# EAGLE design gm-board (EAGLE 6.6.0)
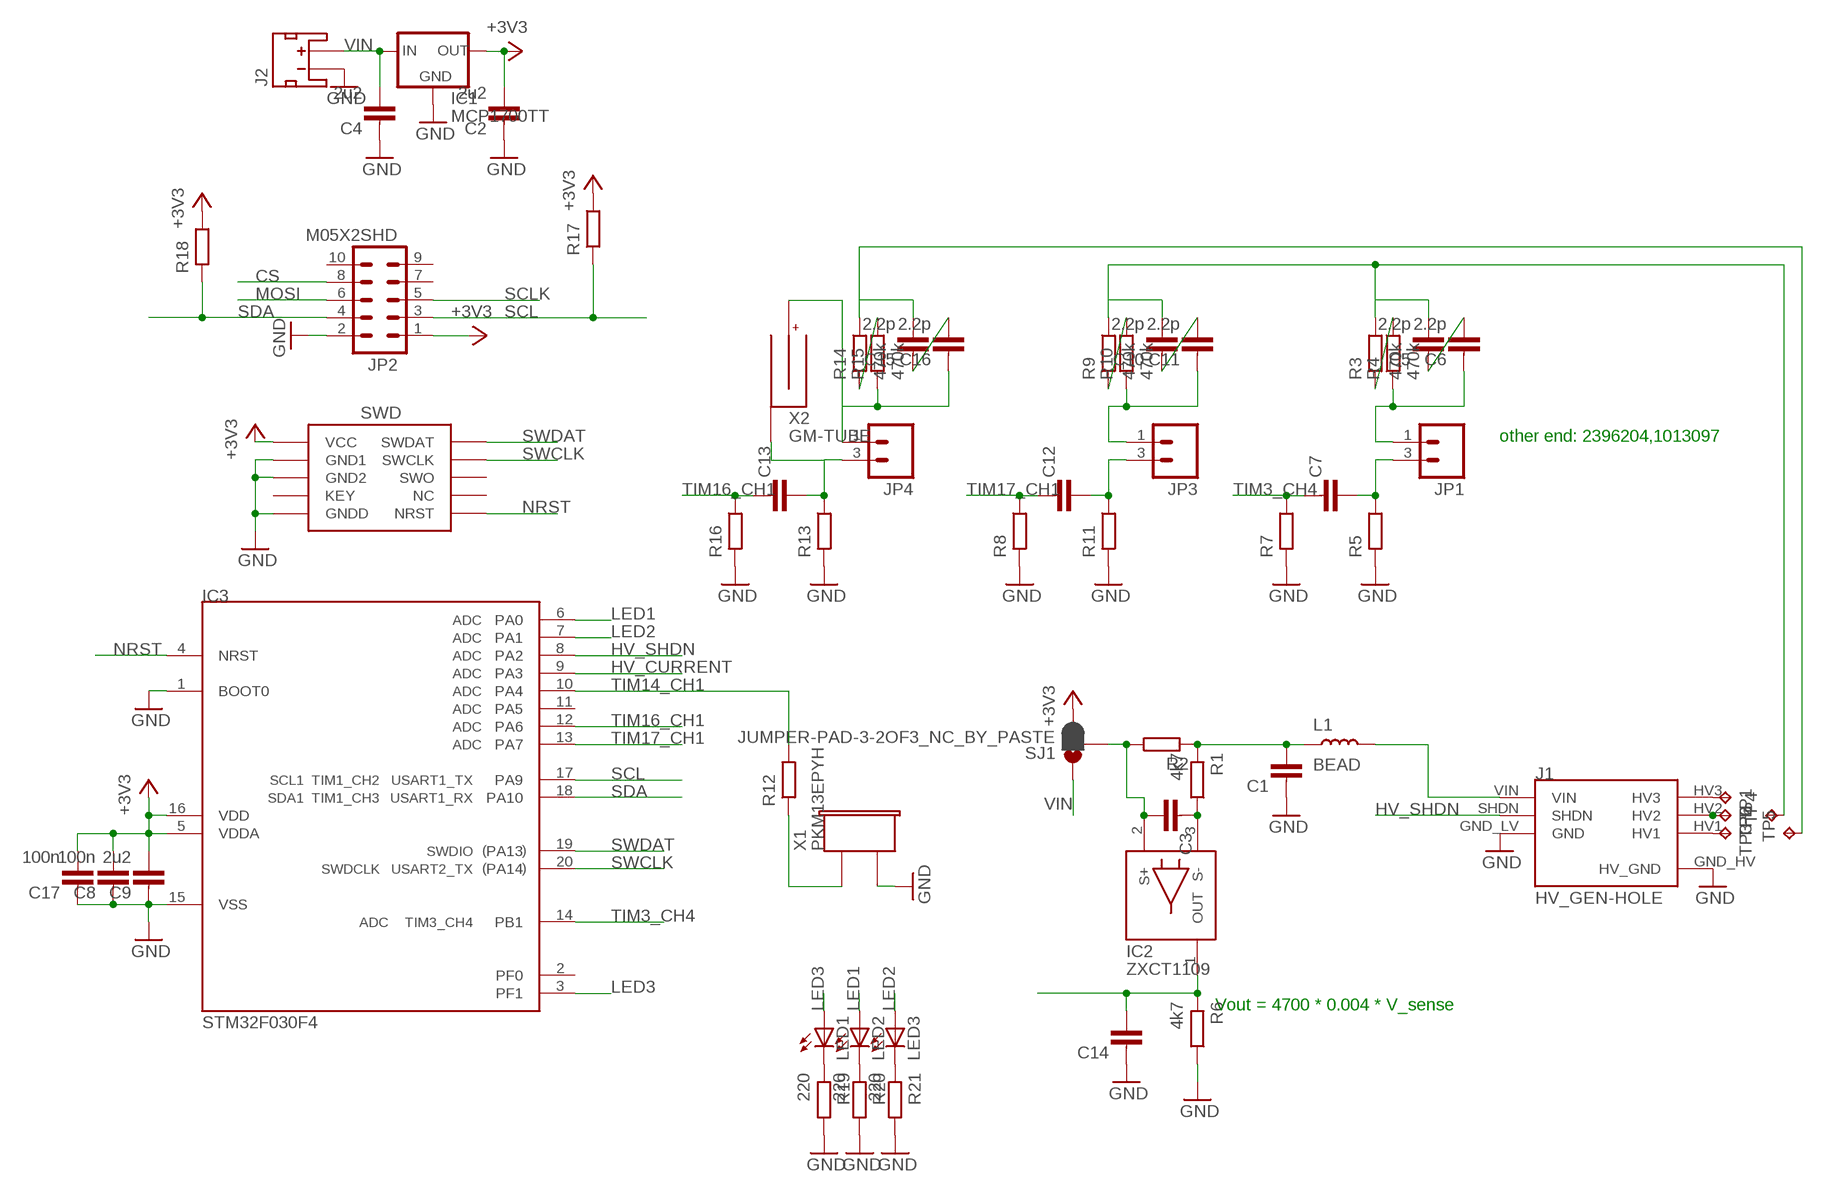
[diagram p0: schematic, sheet 1]

## Parts
C1  CAPACITOR0603-N  [C0603-N]
C2  2u2  CAPACITOR0603-N  [C0603-N]
C3  CAPACITOR0603-N  [C0603-N]
C4  2u2  CAPACITOR0603-N  [C0603-N]
C5  2.2p  CAPACITOR0805-N  [C0805-N]
C6  2.2p  CAPACITOR0805-N  [C0805-N]
C7  CAPACITOR0603-N  [C0603-N]
C8  100n  CAPACITOR0603-N  [C0603-N]
C9  2u2  CAPACITOR0603-N  [C0603-N]
C10  2.2p  CAPACITOR0805-N  [C0805-N]
C11  2.2p  CAPACITOR0805-N  [C0805-N]
C12  CAPACITOR0603-N  [C0603-N]
C13  CAPACITOR0603-N  [C0603-N]
C14  CAPACITOR0603-N  [C0603-N]
C15  2.2p  CAPACITOR0805-N  [C0805-N]
C16  2.2p  CAPACITOR0805-N  [C0805-N]
C17  100n  CAPACITOR0603-N  [C0603-N]
IC1  MCP1700TT  [SOT23]
IC2  ZXCT1109  [SOT23]
IC3  STM32F030F4  [TSSOP20]
J1  HV_GEN-HOLE  [BRD-LAYOUT2]
J2  JST_2MM_MALE_TH-NT  [JST-2-TH-NOTEXT]
J3  SWD_SHROUD  [SWD_PTH_SHROUD]
JP1  M02-HV  [M03-HV]
JP2  M05X2SHD  [2X5-SHROUDED]
JP3  M02-HV  [M03-HV]
JP4  M02-HV  [M03-HV]
L1  BEAD  INDUCTOR0603-N  [L0603-N]
LED1  LEDCHIPLED_0603  [CHIPLED_0603]
LED2  LEDCHIPLED_0603  [CHIPLED_0603]
LED3  LEDCHIPLED_0603  [CHIPLED_0603]
R1  4k7  RESISTOR0603-N  [R0603-N]
R2  RESISTOR0603-N  [R0603-N]
R3  470k  RESISTOR1206-N  [R1206-N]
R4  470k  RESISTOR1206-N  [R1206-N]
R5  RESISTOR0603-N  [R0603-N]
R6  4k7  RESISTOR0603-N  [R0603-N]
R7  RESISTOR0603-N  [R0603-N]
R8  RESISTOR0603-N  [R0603-N]
R9  470k  RESISTOR1206-N  [R1206-N]
R10  470k  RESISTOR1206-N  [R1206-N]
R11  RESISTOR0603-N  [R0603-N]
R12  RESISTOR0603-N  [R0603-N]
R13  RESISTOR0603-N  [R0603-N]
R14  470k  RESISTOR1206-N  [R1206-N]
R15  470k  RESISTOR1206-N  [R1206-N]
R16  RESISTOR0603-N  [R0603-N]
R17  RESISTOR0603-N  [R0603-N]
R18  RESISTOR0603-N  [R0603-N]
R19  220  RESISTOR0603-N  [R0603-N]
R20  220  RESISTOR0603-N  [R0603-N]
R21  220  RESISTOR0603-N  [R0603-N]
SJ1  JUMPER-PAD-3-2OF3_NC_BY_PASTE  [PAD-JUMPER-3-2OF3_NC_BY_PASTE_YES_SILK_FULL_BOX]
TP1  TPTP09R  [TP09R]
TP2  TPTP09R  [TP09R]
TP3  TPTP09R  [TP09R]
TP4  TPTP09R  [TP09R]
TP5  TPTP09R  [TP09R]
TP6  TPTP09R  [TP09R]
X1  PKM13EPYH  [PKM13EPYH]
X2  GM-TUBE  [GM-TUBE]

## Nets
+3V3: C2.2 C8.2 C9.2 C17.2 IC1.2(OUT) IC3.5(VDDA) IC3.16(VDD) J3.1(VCC) JP2.1 R17.2 R18.2 SJ1.3
CS: JP2.8
GND: C1.1 C2.1 C4.1 C8.1 C9.1 C14.1 C17.1 IC1.1(GND) IC3.1(BOOT0) IC3.15(VSS) J1.GND_HV(HV_GND) J1.GND_LV(GND) J2.2(-) J3.3(GND1) J3.5(GND2) J3.9(GNDD) JP2.2 R5.1 R6.2 R7.1 R8.1 R11.1 R13.1 R16.1 R19.2 R20.2 R21.2 X1.2
HV_CURRENT: C14.2 IC2.1(OUT) IC3.9(PA3) R6.1
HV_SHDN: IC3.8(PA2) J1.SHDN
LED1: IC3.6(PA0) LED2.A
LED2: IC3.7(PA1) LED3.A
LED3: IC3.3(PF1) LED1.A
MOSI: JP2.6
N$1: C13.2 JP4.3 R13.2 X2.B1(-) X2.B2(-)
N$2: J1.VIN L1.2
N$3: C16.1 JP4.1 R15.1 X2.A1(+) X2.A2(+)
N$4: R14.1 R15.2
N$5: C12.2 JP3.3 R11.2
N$6: R12.1 X1.1
N$7: C1.2 L1.1 R1.1 R2.1
N$8: C15.2 R14.2 TP5.TP
N$9: C7.2 JP1.3 R5.2
N$10: J1.HV3 TP1.TP
N$11: C3.2 IC2.2(S+) R2.2 SJ1.2
N$12: J1.HV2 TP2.TP TP6.TP
N$13: J1.HV1 TP3.TP
N$14: LED1.C R19.1
N$15: LED2.C R20.1
N$16: C15.1 C16.2
N$17: LED3.C R21.1
N$18: C3.1 IC2.3(S-) R1.2
N$19: C11.1 JP3.1 R10.1
N$20: C5.2 C10.2 R3.2 R9.2 TP4.TP
N$21: R9.1 R10.2
N$22: C10.1 C11.2
N$23: C6.1 JP1.1 R4.1
N$25: R3.1 R4.2
N$26: C5.1 C6.2
NRST: IC3.4(NRST) J3.10(NRST)
SCL: IC3.17(PA9) JP2.3 R17.1
SCLK: JP2.5
SDA: IC3.18(PA10) JP2.4 R18.1
SWCLK: IC3.20(PA14) J3.4(SWCLK)
SWDAT: IC3.19(PA13) J3.2(SWDAT)
TIM3_CH4: C7.1 IC3.14(PB1) R7.2
TIM14_CH1: IC3.10(PA4) R12.2
TIM16_CH1: C13.1 IC3.12(PA6) R16.2
TIM17_CH1: C12.1 IC3.13(PA7) R8.2
VIN: C4.2 IC1.3(IN) J2.1(+) SJ1.1
Unconnected: IC3.2(PF0) IC3.11(PA5) J3.6(SWO) J3.7(KEY) J3.8(NC) JP2.7 JP2.9 JP2.10

## Notes on the sheet
- other end: 2396204,1013097
- Vout = 4700 * 0.004 * V_sense

## Library data of the parts
C1 C3 C7 C8 C12-C14 C17 = passives-7351:CAPACITOR
C2 C4 C9 = passives-7351:CAPACITOR; FARNELL: 2496923
C5 C6 C10 C11 C15 C16 = passives-7351:CAPACITOR; FARNELL: 1855767
IC1 = dtb:MCP1700; FANRELL: 1296592
IC2 = dtb:ZXCT1109; FARNELL: 1904028
IC3 = dtb:STM32F030F4; FARNELL: 2393635
J1 = generator-lib:HV_GEN
J2 = dtb:JST_2MM_MALE_TH: Mates to single-cell LiPo batteries. CONN-08352
J3 = dtb:SWD_SHROUD
JP1 JP3 JP4 = Mine:M02: Header 2 Standard 2-pin 0.1" header. Use with straight break away headers (SKU : PRT-00116), right angle break away headers (PRT-00553), swiss pins (PRT-00743), machine pins (PRT-00117), and female headers (PRT-00115). Molex polarized connector foot print use with SKU : PRT-08233 with associated crimp pins and housings.; FARNELL: 1462950
JP2 = SparkFun-Connectors:M05X2: Header 5x2 Standard 10-pin dual row 0.1" header. Commonly used with AVR-ISP. Use with Spark Fun Electronics SKU: PRT-00778
L1 = passives-7351:INDUCTOR; FARNELL: 1781093
LED1-LED3 = dtb:LED: LED OSRAM: - CHIPLED LG R971, LG N971, LY N971, LG Q971, LY Q971, LO R971, LY R971 LH N974, LH R974 LS Q976, LO Q976, LY Q976 LO Q996 - Hyper CHIPLED LW Q18S LB Q993, LB Q99A, LB R99A - SideLED LS A670, LO A670, LY A670, LG A670, LP A670 LB A673, LV A673, LT A673, LW A673 LH A674 LY A675 LS A676, LA A676, LO A676, LY A676, LW A676 LS A679, LY A679, LG A679 - Hyper Micro SIDELED® LS Y876, LA Y876, LO Y876, LY Y876 LT Y87S - SmartLED LW L88C, LW L88S LB L89C, LB L89S, LG L890 LS L89K, LO L89K, LY L89K LS L896, LA L896, LO L896, LY L896 - TOPLED LS T670, LO T670, LY T670, LG T670, LP T670 LSG T670, LSP T670, LSY T670, LOP T670, LYG T670 LG T671, LOG T671, LSG T671 LB T673, LV T673, LT T673, LW T673 LH T674 LS T676, LA T676, LO T676, LY T676, LB T676, LH T676, LSB T676, LW T676 LB T67C, LV T67C, LT T67C, LS T67K, LO T67K, LY T67K, LW E67C LS E67B, LA E67B, LO E67B, LY E67B, LB E67C, LV E67C, LT E67C LW T67C LS T679, LY T679, LG T679 LS T770, LO T770, LY T770, LG T770, LP T770 LB T773, LV T773, LT T773, LW T773 LH T774 LS E675, LA E675, LY E675, LS T675 LS T776, LA T776, LO T776, LY T776, LB T776 LHGB T686 LT T68C, LB T68C - Hyper Mini TOPLED® LB M676 - Mini TOPLED Santana® LG M470 LS M47K, LO M47K, LY M47K Source: http://www.osram.convergy.de LUXEON: - LUMILED® LXK2-PW12-R00, LXK2-PW12-S00, LXK2-PW14-U00, LXK2-PW14-V00 LXK2-PM12-R00, LXK2-PM12-S00, LXK2-PM14-U00 LXK2-PE12-Q00, LXK2-PE12-R00, LXK2-PE12-S00, LXK2-PE14-T00, LXK2-PE14-U00 LXK2-PB12-K00, LXK2-PB12-L00, LXK2-PB12-M00, LXK2-PB14-N00, LXK2-PB14-P00, LXK2-PB14-Q00 LXK2-PR12-L00, LXK2-PR12-M00, LXK2-PR14-Q00, LXK2-PR14-R00 LXK2-PD12-Q00, LXK2-PD12-R00, LXK2-PD12-S00 LXK2-PH12-R00, LXK2-PH12-S00 LXK2-PL12-P00, LXK2-PL12-Q00, LXK2-PL12-R00 Source: www.luxeon.com KINGBRIGHT: KA-3528ASYC Source: www.kingbright.com
R1 R5-R8 R11-R13 R15-R21 = passives-7351:RESISTOR
R2 = passives-7351:RESISTOR; FARNELL: 2328089
R3 R4 R9 R10 R14 = passives-7351:RESISTOR; FARNELL: 1576201
SJ1 = SparkFun-Passives:JUMPER-PAD-3-2OF3_NC_BY_PASTE
TP1-TP6 = testpad:TP: Test pad
X1 = Mine:PKM13EPYH; FARNELL: 1823866
X2 = Mine:GM-TUBE

## Board
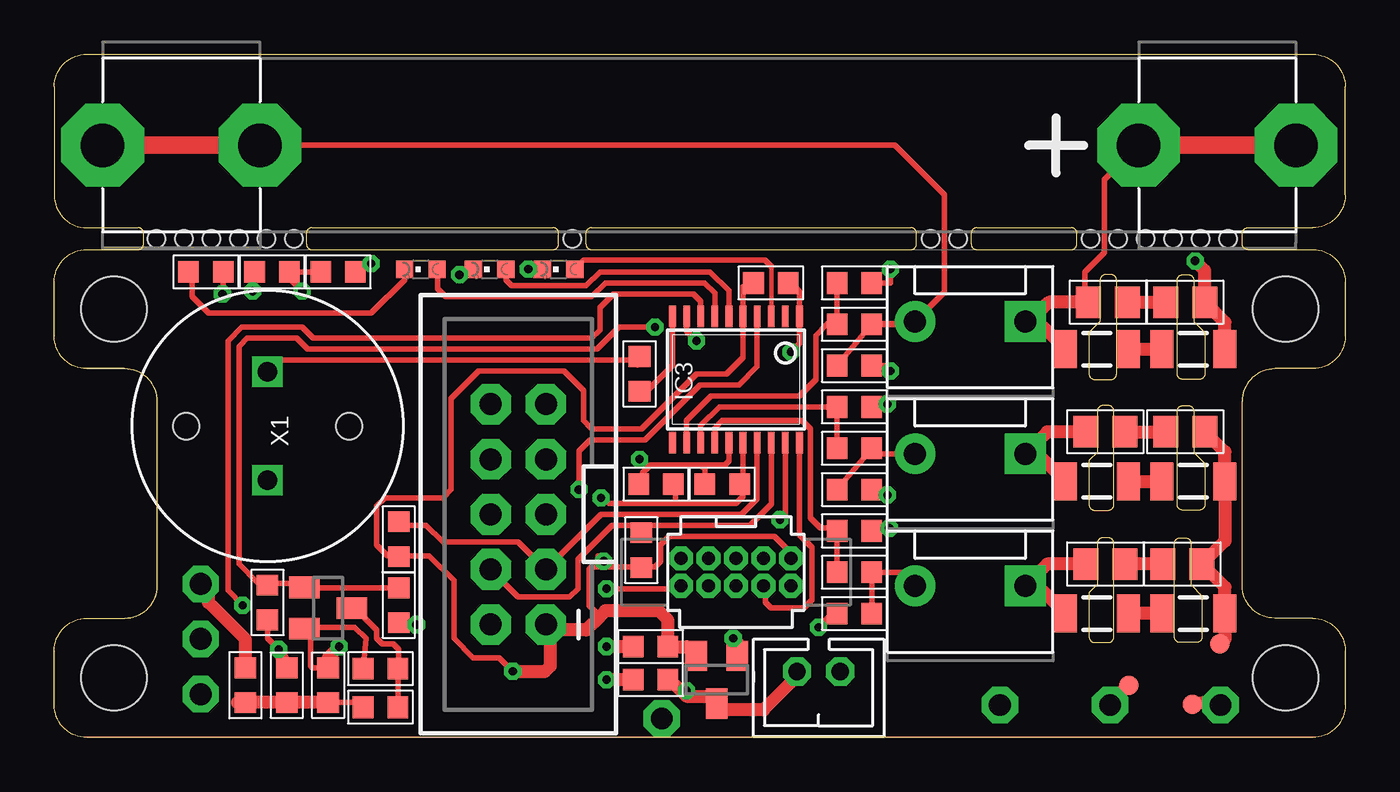
[diagram p1: board, top side]
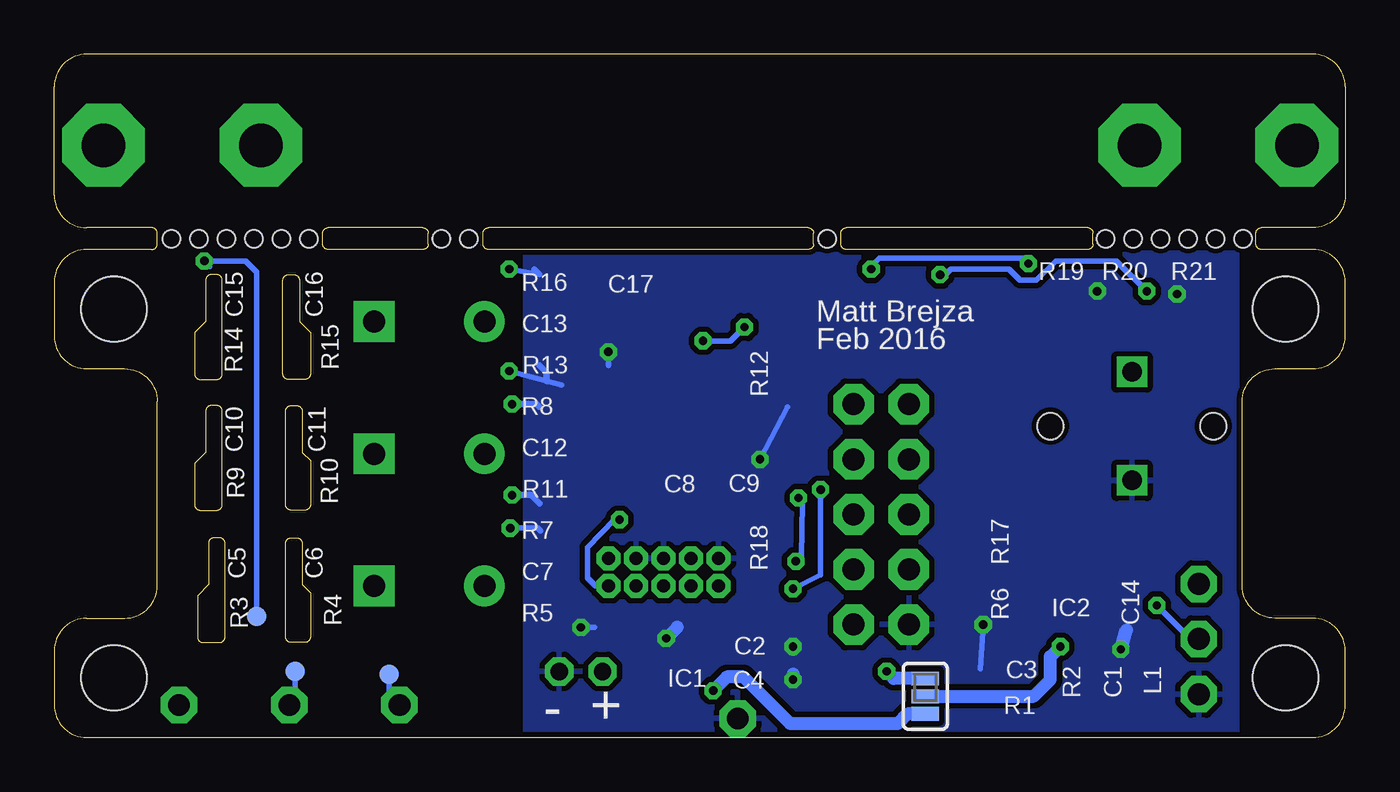
[diagram p2: board, bottom side, seen from below]

Size 59.5 x 31.5 mm. Coordinates in mm from the lower left corner, seen from the top.
Outline: 1.5,0 arc-90 0,1.5 0,4 arc-90 1.5,5.5 3.25,5.5 arc90 4.75,7 4.75,15.5 arc90 3.25,17 1.5,17 arc-90 0,18.5 0,21 arc-90 1.5,22.5 3.87,22.5 arc90 4.12,22.75 4.12,23.25 arc90 3.87,23.5 1.5,23.5 arc-90 0,25 0,30 arc-90 1.5,31.5 58,31.5 arc-90 59.5,30 59.5,25 arc-90 58,23.5 55,23.5 arc90 54.75,23.25 54.75,22.75 arc90 55,22.5 58,22.5 arc-90 59.5,21 59.5,18.5 arc-90 58,17 56.25,17 arc90 54.75,15.5 54.75,7 arc90 56.25,5.5 58,5.5 arc-90 59.5,4 59.5,1.5 arc-90 58,0 1.5,0
Outline: 11.87,22.5 23,22.5 arc90 23.25,22.75 23.25,23.25 arc90 23,23.5 11.87,23.5 arc90 11.62,23.25 11.62,22.75 arc90 11.87,22.5
Outline: 24.75,22.5 39.49,22.5 arc90 39.74,22.75 39.74,23.25 arc90 39.49,23.5 24.75,23.5 arc90 24.5,23.25 24.5,22.75 arc90 24.75,22.5
Outline: 42.51,22.5 46.88,22.5 arc90 47.13,22.75 47.13,23.25 arc90 46.88,23.5 42.51,23.5 arc90 42.26,23.25 42.26,22.75 arc90 42.51,22.5
Outline: 48.96,21.08 arc90 48.71,21.34 48.45,21.34 arc90 48.2,21.08 48.2,19.18 47.69,18.67 47.69,16.76 arc90 47.95,16.51 48.71,16.51 arc90 48.96,16.76 48.96,21.08
Outline: 48.84,15.05 arc90 48.58,15.3 48.33,15.3 arc90 48.07,15.05 48.07,13.14 47.69,12.76 47.69,10.73 arc90 47.95,10.48 48.58,10.48 arc90 48.84,10.73 48.84,15.05
Outline: 48.84,8.95 arc90 48.58,9.21 48.33,9.21 arc90 48.07,8.95 48.07,7.05 47.69,6.67 47.69,4.64 arc90 47.95,4.38 48.58,4.38 arc90 48.84,4.64 48.84,8.95
Outline: 51.76,21.08 arc-90 52.01,21.34 52.26,21.34 arc-90 52.52,21.08 52.52,19.18 53.03,18.67 53.03,16.76 arc-90 52.77,16.51 52.01,16.51 arc-90 51.76,16.76 51.76,21.08
Outline: 51.76,15.05 arc-90 52.01,15.3 52.26,15.3 arc-90 52.52,15.05 52.52,13.14 53.03,12.64 53.03,10.73 arc-90 52.77,10.48 52.01,10.48 arc-90 51.76,10.73 51.76,15.05
Outline: 51.63,8.95 arc-90 51.88,9.21 52.14,9.21 arc-90 52.39,8.95 52.39,7.05 52.9,6.54 52.9,4.64 arc-90 52.65,4.38 51.88,4.38 arc-90 51.63,4.64 51.63,8.95
Copper layers (1*16): Top 0.035mm / dielectric 1.5mm / Bottom 0.035mm
Design rules "default *": minimum track width 8mil, minimum drill 15mil, track to track 8mil, track to pad 8mil, pad to pad 6mil, via to via 8mil, smd to smd 0mil, copper to edge 10mil, drill to drill 8mil, minimum pad ring 10mil, minimum via ring 8mil, stop-mask expansion 4mil, vias tented up to drill 16mil, thermal gap 10mil
Holes 0.8 mm at 11.05,22.99 9.78,22.99 8.51,22.99 7.24,22.99 5.97,22.99 4.7,22.99 23.88,22.99 54.11,22.99 52.84,22.99 51.57,22.99 50.3,22.99 49.03,22.99 47.76,22.99 40.39,22.99 41.66,22.99

### Footprints (pad centres in the part's own frame; a part is rotated, then mirrored left to right if it is on the bottom)
C0603-N = smd 0.95 x 1: 1 -0.8,0; 2 0.8,0
C0805-N = smd 1.15 x 1.45: 1 -0.9,0; 2 0.9,0
SOT23 = smd 1 x 1.4: 1 -0.95,-1.1; 2 0.95,-1.1; 3 0,1.1
TSSOP20 = smd 0.305 x 0.991: 1 -2.925,-2.918; 2 -2.275,-2.918; 3 -1.625,-2.918; 4 -0.975,-2.918; 5 -0.325,-2.918; 6 0.325,-2.918; 7 0.975,-2.918; 8 1.625,-2.918; 9 2.275,-2.918; 10 2.925,-2.918; 11 2.925,2.918; 12 2.275,2.918; 13 1.625,2.918; 14 0.975,2.918; 15 0.325,2.918; 16 -0.325,2.918; 17 -0.975,2.918; 18 -1.625,2.918; 19 -2.275,2.918; 20 -2.925,2.918
BRD-LAYOUT2 = drill 1 pad 1.676 octagon: GND_HV 23.25,0.875; HV1 38.837,1.499; HV2 43.917,1.499; HV3 48.997,1.499 | drill 1.016 pad 1.676 octagon: GND_LV 2,2; SHDN 2,4.54; VIN 2,7.08 | hole 3: 52,2.75; 52,19.75; -2,19.75; -2,2.75
JST-2-TH-NOTEXT = drill 0.8 octagon: 1 1,0; 2 -1,0
SWD_PTH_SHROUD = drill 0.6 octagon: 1 -2.54,-0.635; 2 -2.54,0.635; 3 -1.27,-0.635; 4 -1.27,0.635; 5 0,-0.635; 6 0,0.635; 7 1.27,-0.635; 8 1.27,0.635; 9 2.54,-0.635; 10 2.54,0.635
M03-HV = drill 1.016 pad 1.88 square: 1 1.27,2.54 | drill 1.016 pad 1.88: 3 6.35,2.54
2X5-SHROUDED = drill 1.016 pad 1.88 octagon: 1 -1.27,5.08; 2 1.27,5.08; 3 -1.27,2.54; 4 1.27,2.54; 5 -1.27,0; 6 1.27,0; 7 -1.27,-2.54; 8 1.27,-2.54; 9 -1.27,-5.08; 10 1.27,-5.08
L0603-N = smd 0.95 x 1: 1 -0.8,0; 2 0.8,0
CHIPLED_0603 = smd 0.8 x 0.8: A 0,-0.75; C 0,0.75
R0603-N = smd 0.95 x 1: 1 -0.8,0; 2 0.8,0
R1206-N = smd 1.05 x 1.75: 1 -1.45,0; 2 1.45,0
PAD-JUMPER-3-2OF3_NC_BY_PASTE_YES_SILK_FULL_BOX = smd 0.635 x 1.27: 1 -0.813,0; 2 0,0; 3 0.813,0
TP09R = smd 0.9 x 0.9: TP 0,0
PKM13EPYH = drill 0.9 square: 1 -2.5,0; 2 2.5,0 | hole 1.2: 0,3.75; 0,-3.75
GM-TUBE = drill 2 pad 3.81 octagon: A1 -7.25,0; A2 0,0; B1 40.5,0; B2 47.75,0

### Placement (x,y rotation side)
C1  10.72,2.41 270 top
C2  27.48,4.19 0 top
C3  15.04,3.17 180 top
C4  27.48,2.67 0 top
C5  51.99,8 0 top
C6  48.44,8 0 top
C7  36.88,7.62 0 top
C8  30.79,11.68 0 top
C9  27.74,11.68 0 top
C10  52.12,14.1 0 top
C11  48.44,14.1 0 top
C12  36.88,13.34 0 top
C13  36.88,19.05 0 top
C14  9.83,6.22 90 top
C15  52.12,20.07 0 top
C16  48.56,20.07 0 top
C17  33.02,20.95 180 top
IC1  30.53,2.67 180 top
IC2  12.62,5.97 270 top
IC3  31.42,16.51 180 top
J1  4.75,0 0 top
J2  35.23,3.05 180 top
J3  31.42,7.62 180 top
JP1  46.02,9.53 180 top
JP2  21.39,10.29 180 top
JP3  46.02,15.62 180 top
JP4  46.02,21.72 180 top
L1  8.81,2.41 90 top
LED1  23.25,21.59 90 top
LED2  20.07,21.59 90 top
LED3  16.89,21.59 90 top
R1  15.04,1.4 0 top
R2  12.62,2.41 90 top
R3  52.5,5.71 0 top
R4  48.06,5.71 0 top
R5  36.88,5.71 0 top
R6  15.88,6.1 270 top
R7  36.88,9.53 180 top
R8  36.88,15.24 180 top
R9  52.5,11.81 0 top
R10  48.06,11.81 0 top
R11  36.88,11.43 180 top
R12  26.98,16.76 270 top
R13  36.88,17.14 180 top
R14  52.5,17.91 0 top
R15  48.06,17.91 0 top
R16  36.88,20.95 180 top
R17  15.88,9.14 270 top
R18  27.05,8.64 270 top
R19  13.09,21.46 180 top
R20  10.04,21.46 0 top
R21  6.99,21.46 0 top
SJ1  19.36,1.91 90 bottom
TP1  52.45,1.52 0 top
TP2  49.53,2.41 0 top
TP3  44.07,2.92 0 bottom
TP4  53.73,4.32 0 top
TP5  50.17,5.59 0 bottom
TP6  48.39,3.05 0 bottom
X1  9.83,14.36 270 top
X2  49.98,27.3 180 top

### Tracks (layer width: path | path; a pad name or v marks a point on that pad's centre or on a via)
+3V3  (via drill 0.38)
  Top 0.254: IC3.5 31.75,20.8 C17.2 | IC3.16 31.75,11.59 | 31.75,11.59 C8.2 | J3.1 33.96,8.51 33.2,9.27 28.32,9.27 27.94,8.89 27.94,8.13 27.69,7.87 27.18,7.87 | 31.75,11.59 31.75,11.12 31.42,10.79 28.75,10.79 | 28.75,10.79 28.63,10.92 28.63,11.6 C9.2 | 28.75,10.79 25.58,10.79 v25.2,11.05 | v25.32,8.13 25.07,8.38 | IC3.5 31.75,20.5 | 27.18,7.87 25.58,7.87 v25.32,8.13 | R18.2 27.14,7.84 27.18,7.87 | IC3.5 31.75,17.52 30.99,16.76 29.59,16.76 27.05,14.22 24.77,14.22 24.39,14.61 24.39,16 23.5,16.89 19.56,16.89 18.29,15.62 18.29,11.43 17.91,11.05 15.24,11.05 14.86,10.67 14.86,8.89 15.37,8.38 15.88,8.38 | v21.13,3.05 20.5,3.68 19.31,3.68 18.42,4.57 18.42,7.24 17.28,8.38 15.88,8.38 | JP2.1 22.66,5.76 | v25.32,8.13 25.07,7.87 24.77,7.87 24.64,7.75 24.64,6.1 25.15,5.59 | 22.91,4.95 22.91,4.87 22.86,4.83 | R17.2 15.88,8.38
  Top 0.61: IC1.2 29.16,4.19 C2.2 28.28,5.42 27.86,5.84 25.4,5.84 25.15,5.59 24.52,4.95 22.91,4.95 JP2.1 | v21.13,3.05 22.61,3.05 22.86,3.3 22.86,4.83 22.86,5
  Bottom 0.254: v25.2,11.05 25.2,10.97 25.02,10.79 25.07,8.38 v25.32,8.13
  Bottom 0.61: SJ1.3 20.8,2.72 v21.13,3.05
GND  (via drill 0.38)
  Top 0.254: C17.1 33.96,20.95 34.34,20.57 IC3.1 34.34,18.16 v33.96,17.78 | R5.1 35.87,5.71 v35.23,5.08 | R16.1 38.53,20.95 v38.53,21.59 | C8.1 29.98,12.36 29.77,12.57 | 29.77,12.57 27.48,12.57 27.29,12.38 | 27.29,12.38 27.1,12.19 27.1,11.85 C9.1 | v26.98,12.83 26.98,12.7 27.29,12.38 | IC3.15 31.09,12.76 30.91,12.57 29.77,12.57 | R13.1 38.28,17.14 v38.53,16.89 | R8.1 38.28,15.24 v38.41,15.37 | R11.1 38.15,11.43 v38.41,11.18 | R6.2 v16.69,5.21 | R21.2 7.79,20.48 v7.75,20.45 | R19.2 R20.2 10.84,21.17 v11.43,20.57 | C14.1 9.83,4.57 v10.34,4.06 | R7.1 38.36,9.53 v38.48,9.65
  Top 0.61: C1.1 v10.34,4.06 | IC1.1 31.48,4.38 v31.29,4.57 | C2.1 v25.45,4.19 | C4.1 v25.45,2.67
  Bottom 0.254: v16.69,5.21 16.82,3.17 | v35.23,5.08 34.59,5.08 | v26.98,12.83 25.7,15.24 | v38.53,21.59 37.13,21.34 37.39,21.59 | v38.53,16.89 36.12,16.26 | v33.96,17.78 33.96,17.14 | v38.41,15.37 38.53,15.37 | v38.41,11.18 38.53,11.18 | v7.75,20.45 7.75,20.19 | v11.43,20.57 11.43,20.45 | v38.48,9.65 37.22,9.65 37.09,9.53
  Bottom 0.305: v38.41,11.18 37.52,11.18 37.13,10.79 | v38.41,15.37 37.26,15.37 37.13,15.24 | 36.82,16.44 36.82,16.83 37.13,17.14
  Bottom 0.61: v10.34,4.06 10.08,4.95 | v31.29,4.57 30.79,5.08 | v25.45,4.19 25.45,4.06 | v25.45,2.67 25.45,2.92
  pour Bottom (isolate 0.254): 37.77,0 5,0 5,22.35 37.77,22.23
HV_CURRENT  (via drill 0.38)
  Top 0.254: 9.91,7.11 9.4,7.11 8.52,8 8.52,18.03 8.9,18.41 11.18,18.41 11.69,17.91 25.02,17.91 26.04,18.92 v27.69,18.92 | 9.91,7.11 11.46,7.11 IC2.1 11.55,6.9 R6.1 | C14.2 9.83,7.03 9.91,7.11 | IC3.9 29.14,18.74 v29.59,18.29
  Bottom 0.254: v29.59,18.29 28.32,18.29 v27.69,18.92
HV_SHDN  (via drill 0.38)
  Top 0.254: v8.69,6.1 8.01,6.77 8.01,18.29 8.64,18.92 11.43,18.92 11.94,18.41 24.77,18.41 25.15,18.8 25.15,19.81 25.79,20.45 29.47,20.45 29.8,20.12 IC3.8
  Bottom 0.254: J1.SHDN 7.13,4.54 v8.69,6.1
LED1
  Top 0.254: IC3.6 31.09,20.6 30.23,21.46 25.15,21.46 24.52,20.83 21.09,20.83 20.83,21.08 20.83,21.58 LED2.A
LED2
  Top 0.254: IC3.7 30.45,20.49 29.98,20.95 25.4,20.95 24.77,20.32 18.04,20.32 17.66,20.7 17.66,21.58 LED3.A
LED3
  Top 0.203: IC3.3 33.05,21.7
  Top 0.254: 33.05,21.7 32.75,22 24.41,22 LED1.A
N$1
  Top 0.254: R13.2 C13.2 | 9.91,27.3 38.74,27.3 41.02,25.02 41.02,20.53 JP4.3
  Top 0.305: 39.55,19.56 39.36,19.37 39.04,19.05 C13.2
  Top 0.406: JP4.3 39.55,19.18 39.36,19.37
  Top 0.813: X2.B2 X2.B1 9.91,27.3
N$2
  Top 0.61: L1.2 8.81,4.53 7.12,6.22 7.12,6.71 J1.VIN
N$3
  Top 0.254: 49.98,27.24 X2.A2 48.39,25.72 48.39,22.35 47.5,21.46 47.5,20.23 C16.1
  Top 0.61: R15.1 45.34,19.18 JP4.1 45.01,19.43 45.22,19.43 45.85,20.07 C16.1
  Top 0.813: X2.A1 X2.A2
N$4
  Top 0.61: R15.2 R14.1
N$5
  Top 0.254: R11.2 C12.2 37.94,13.08 JP3.3
N$6
  Top 0.254: R12.1 26.89,17.18 26.67,17.4 10.38,17.4 X1.1
N$7
  Top 0.254: R2.1 14.2,1.61 R1.1
  Top 0.61: R2.1 C1.2 L1.1 8.43,1.61
N$8  (via drill 0.38)
  Top 0.61: v52.58,21.97 53.02,21.53 C15.2 53.95,19.14 R14.2
  Bottom 0.254: 52.33,21.72 v52.58,21.97 50.68,21.97 50.17,21.46 TP5.TP
N$9
  Top 0.254: R5.2 C7.2 39.04,7.62 JP1.3
N$10
  Top 0.61: TP1.TP 54.11,1.86 J1.HV3
N$11  (via drill 0.38)
  Top 0.254: C3.2 14.36,4.56 13.85,5.08 11.72,5.08 IC2.2 11.81,4.98 11.81,3.3 11.9,3.21 R2.2
  Top 0.61: R2.2 12.62,3.68 v13.13,4.19
  Bottom 0.61: SJ1.2 14.36,1.91 13.59,2.67 13.59,3.73 v13.13,4.19
N$12
  Top 0.61: TP2.TP 48.9,1.85 J1.HV2
  Bottom 0.254: TP6.TP 48.39,1.77 J1.HV2
N$13
  Bottom 0.254: TP3.TP 44.07,1.99 J1.HV1
N$14  (via drill 0.38)
  Top 0.254: LED1.C v21.85,21.59 | v14.61,21.84 14.27,21.84 R19.1
  Bottom 0.254: v21.85,21.59 21.85,21.72 21.47,22.1 14.86,22.1 v14.61,21.84
N$15  (via drill 0.38)
  Top 0.254: LED2.C 18.67,21.59 v18.67,21.34 | v9.15,20.57 9.15,21.37 R20.1
  Bottom 0.254: v18.67,21.34 18.42,21.34 18.16,21.59 15.5,21.59 14.99,21.08 14.23,21.08 13.34,21.97 10.54,21.97 v9.15,20.57
N$16
  Top 0.61: C16.2 C15.1
N$17
  Top 0.254: LED3.C 16.14,21.09 14.61,19.56 7.12,19.56 6.35,20.32 6.35,21.3 R21.1
N$18
  Top 0.254: R1.2 C3.1 15.88,3.51 15.88,4.06 15.62,4.32 15.12,4.32 14.86,4.57 14.86,4.95 13.72,6.09 IC2.3
N$19
  Top 0.61: R10.1 45.34,13.08 JP3.1 45.77,14.1 C11.1
N$20
  Top 0.61: C10.2 53.95,13.17 R9.2 53.95,9.06 C5.2 53.95,6.94 R3.2 53.95,4.54 TP4.TP
N$21
  Top 0.61: R10.2 R9.1
N$22
  Top 0.61: C11.2 C10.1
N$23
  Top 0.61: R4.1 45.34,6.99 JP1.1 45.77,8 C6.1
N$25
  Top 0.61: R3.1 R4.2
N$26
  Top 0.61: C5.1 C6.2
NRST  (via drill 0.38)
  Top 0.254: IC3.4 32.4,17.1 31.55,16.26 29.77,16.26 27.23,13.72 24.69,13.72 24.18,13.21 v24.18,11.43 | v25.45,6.86 28.75,6.86 J3.10
  Bottom 0.254: v24.18,11.43 24.18,7.49 v25.45,6.86
SCL
  Top 0.254: IC3.17 32.4,11.01 31.67,10.29 25.2,10.29 JP2.3 21.39,9.02 17.91,9.02 17.15,9.78 16.04,9.78 R17.1
SDA
  Top 0.254: IC3.18 33.05,10.77 32.05,9.78 26.93,9.78 | 26.93,9.78 25.7,9.78 24.13,8.21 24.13,6.86 23.75,6.48 21.39,6.48 JP2.4 20.2,7.75 20.2,7.49 | R18.1 27.05,9.65 26.93,9.78
SWCLK
  Top 0.254: IC3.20 34.34,9.35 34.93,8.76 34.93,6.35 34.55,5.97 33.02,5.97 32.77,6.22 32.77,6.91 J3.4
SWDAT  (via drill 0.38)
  Top 0.254: IC3.19 33.7,10.29 v33.45,10.04
  Bottom 0.254: J3.2 34.55,6.99 34.93,7.37 34.93,8.76 34.29,9.4 33.66,10.08 v33.45,10.04
TIM3_CH4
  Top 0.254: IC3.14 30.45,14.27 30.79,14.61 34.47,14.61 34.85,14.22 34.85,10.11 35.31,9.65 35.95,9.65 R7.2 C7.1
TIM14_CH1
  Top 0.254: R12.2 27.32,15.96 28.5,17.14 IC3.10
TIM16_CH1
  Top 0.254: R16.2 C13.1 35.61,19.05 35.1,18.54 35.1,16.51 34.34,15.75 30.28,15.75 29.14,14.62 IC3.12
TIM17_CH1
  Top 0.254: IC3.13 29.8,14.38 30.66,15.24 R8.2 C12.1
VIN  (via drill 0.38)
  Top 0.61: J2.1 34.23,2.81 32.69,1.27 30.83,1.27 IC1.3 30.19,1.91 29.39,1.91 | C4.2 28.37,2.67 29.13,1.91 29.39,1.91 | v29.13,2.16 29.39,1.91
  Bottom 0.61: SJ1.1 20.17,1.09 20.62,0.64 25.58,0.64 27.74,2.79 28.5,2.79 v29.13,2.16

### Text on the board
bPlace: Matt Brejza | Feb 2016 | + | -